# Altium project Split-Keyboard-V3-36keys.PrjPcb
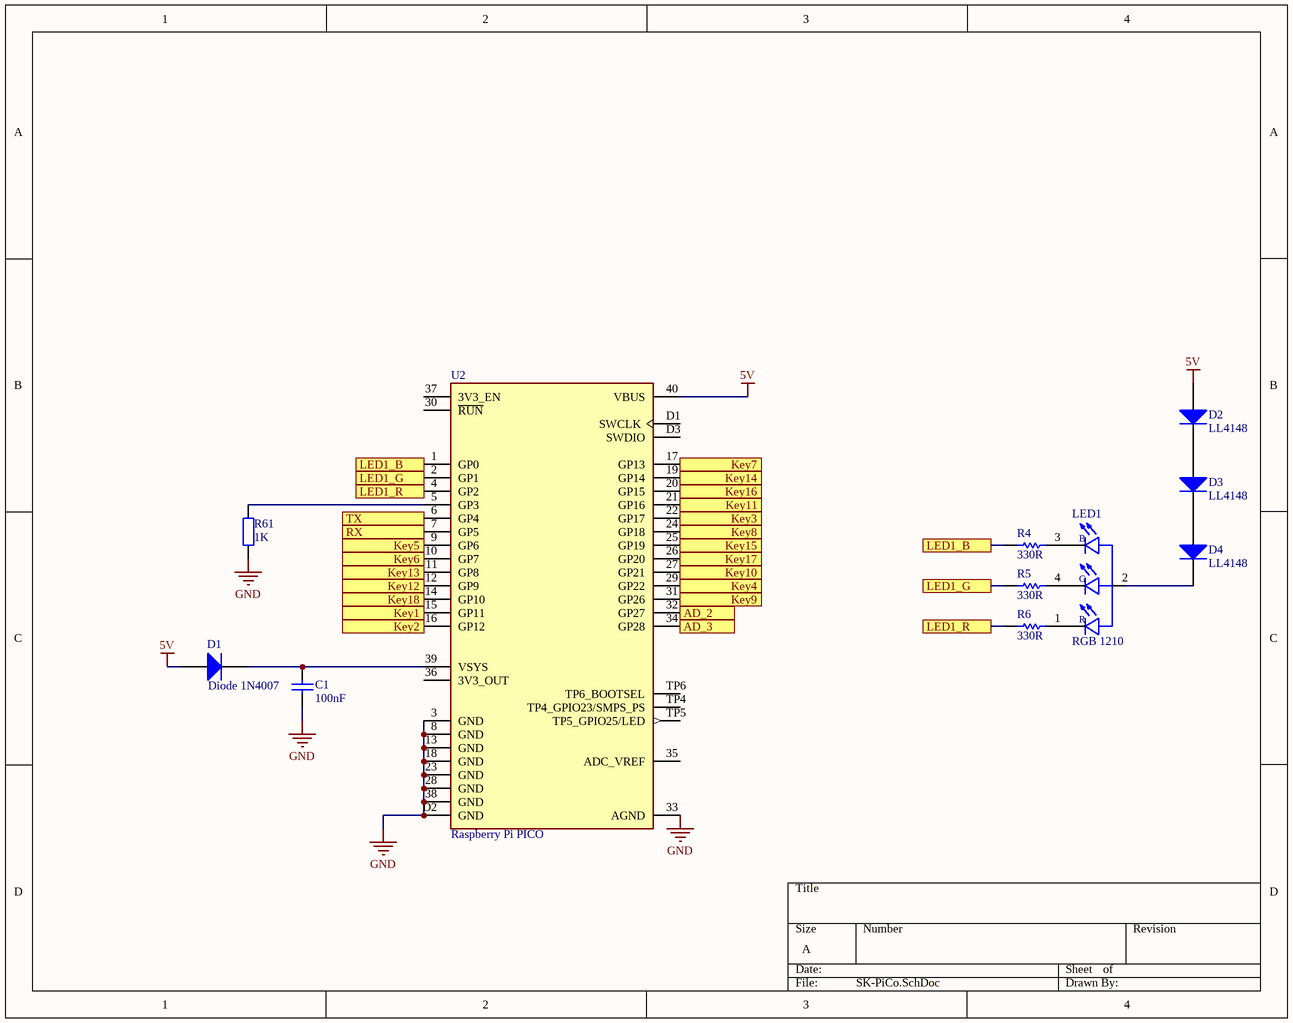
[diagram p0: SK-PiCo.SchDoc]
4 sheets, 86 parts. Net scope: flat (ports and power ports of the same name join across sheets).
Board files: SK-V101-010301.PcbDoc, SK-V101-010301-Left.PcbDoc
Sheets:
  SK-PiCo.SchDoc
  SK-Connector.SchDoc
  SK-Additional_keys.SchDoc
  SK-keys.SchDoc

## Sheet SK-PiCo.SchDoc
size A; SheetNumber: 1; SheetTotal: 4; SPICEModelCacheARYZQBPR: <root> / <DocumentId>ARYZQBPR</DocumentId> / <CacheFrame Number="0"> / <Model Name="1n4007" Kind="MDL"> / <Text>*1N4007 MCE 8-16-95 / *1000V 1A Si GenPurpose Diode pkg:DIODE0.4 1,2 / .MODEL 1N4007 D(IS=2.55E-9 RS=0.042 N=1.75 TT=5.76E-6 CJO=1.85E-11 / + VJ=0.75 M=0.333 BV=1000 IBV=9.86E-5 )</Text> / </Model> / </CacheFrame> / </root>

### Parts
C1  100nF  [SMH_RES0805-STD]
D1  Diode 1N4007  [SMH_SMA]
D2  LL4148  [SMH_MINIMELF]
D3  LL4148  [SMH_MINIMELF]
D4  LL4148  [SMH_MINIMELF]
LED1  RGB 1210  [SMH_LED_1210-RGB]
R4  330R  [SMH_1206STD]
R5  330R  [SMH_1206STD]
R6  330R  [SMH_1206STD]
R61  1K  [SMH_RES0805-STD]
U2  Raspberry Pi PICO  [SMH_PicoPi]

### Ports
AD_2, AD_3, Key1, Key2, Key3, Key4, Key5, Key6, Key7, Key8, Key9, Key10, Key11, Key12, Key13, Key14, Key15, Key16, Key17, Key18, LED1_B, LED1_G, LED1_R, RX, TX

### Nets
5V: D1.1(A) D2.1(A) U2.40(VBUS)
GND: C1.2 R61.2 U2.3(GND) U2.8(GND) U2.13(GND) U2.18(GND) U2.23(GND) U2.28(GND) U2.33(AGND) U2.38(GND) U2.D2(GND)
AD_2: U2.32(GP27) ; port AD_2
AD_3: U2.34(GP28) ; port AD_3
Key1: U2.15(GP11) ; port Key1
Key2: U2.16(GP12) ; port Key2
Key3: U2.22(GP17) ; port Key3
Key4: U2.29(GP22) ; port Key4
Key5: U2.9(GP6) ; port Key5
Key6: U2.10(GP7) ; port Key6
Key7: U2.17(GP13) ; port Key7
Key8: U2.24(GP18) ; port Key8
Key9: U2.31(GP26) ; port Key9
Key10: U2.27(GP21) ; port Key10
Key11: U2.21(GP16) ; port Key11
Key12: U2.12(GP9) ; port Key12
Key13: U2.11(GP8) ; port Key13
Key14: U2.19(GP14) ; port Key14
Key15: U2.25(GP19) ; port Key15
Key16: U2.20(GP15) ; port Key16
Key17: U2.26(GP20) ; port Key17
Key18: U2.14(GP10) ; port Key18
LED1_B: R4.2 U2.1(GP0) ; port LED1_B
LED1_G: R5.2 U2.2(GP1) ; port LED1_G
LED1_R: R6.2 U2.4(GP2) ; port LED1_R
RX: U2.7(GP5) ; port RX
TX: U2.6(GP4) ; port TX
NetC1_1: C1.1 D1.2(K) U2.39(VSYS)
NetD2_2: D2.2(K) D3.1(A)
NetD3_2: D3.2(K) D4.1(A)
NetD4_2: D4.2(K) LED1.2(Anode)
NetLED1_1: LED1.1(R) R6.1
NetLED1_3: LED1.3(B) R4.1
NetLED1_4: LED1.4(G) R5.1
NetR61_1: R61.1 U2.5(GP3)

Not connected (* = marked no-connect by the designer): U2 30(~{RUN}) 35(ADC_VREF) 36(3V3_OUT) 37(3V3_EN) D1(SWCLK) D3(SWDIO) TP4(TP4_GPIO23/SMPS_PS) TP5(TP5_GPIO25/LED) TP6(TP6_BOOTSEL)

### Library data of the parts
C1 = Cap: Capacitor; Published: 8-Jun-2000; LatestRevisionDate: 17-Jul-2002; LatestRevisionNote: Re-released for DXP Platform.; PackageReference: RAD-0.3; Publisher: Altium Limited; Value: 100nF
D1 = Diode 1N4007: 1 Amp General Purpose Rectifier; Published: 8-Jun-2000; LatestRevisionDate: 17-Jul-2002; LatestRevisionNote: Re-released for DXP Platform.; DatasheetVersion: 1998; PackageVersion: Aug-1999; PackageReference: DO-41; Publisher: Altium Limited; PackageDescription: Diode, Axial; Body 5.2 x 2.7 mm (LxDia. max), Lead Dia. 0.86 mm (max); Code_JEDEC: DO-204-AL; ComponentLink1Description: Manufacturer Link; ComponentLink1URL: http://www.fairchildsemi.com/; ComponentLink2Description: Datasheet; ComponentLink2URL: http://www.fairchildsemi.com/ds/1N%2F1N4001.pdf
D2-D4 = Diode 1N4004: 1 Amp General Purpose Rectifier; Published: 8-Jun-2000; LatestRevisionDate: 17-Jul-2002; LatestRevisionNote: Re-released for DXP Platform.; DatasheetVersion: 1998; PackageVersion: Aug-1999; PackageReference: DO-41; Publisher: Altium Limited; PackageDescription: Diode, Axial; Body 5.2 x 2.7 mm (LxDia. max), Lead Dia. 0.86 mm (max); Code_JEDEC: DO-204-AL; ComponentLink1Description: Manufacturer Link; ComponentLink1URL: http://www.fairchildsemi.com/; ComponentLink2Description: Datasheet; ComponentLink2URL: http://www.fairchildsemi.com/ds/1N%2F1N4001.pdf
LED1 = LED RGB: Value: RGB 1210
R4-R6 = Res1: Resistor; Published: 8-Jun-2000; LatestRevisionDate: 17-Jul-2002; LatestRevisionNote: Re-released for DXP Platform.; PackageReference: AXIAL-0.3; Publisher: Altium Limited; PackageDescription: Axial Device, Thru-Hole; 2 Leads; 0.3 in Pin Spacing; Value: 330R
R61 = Res2: Resistor; Published: 8-Jun-2000; LatestRevisionDate: 17-Jul-2002; LatestRevisionNote: Re-released for DXP Platform.; PackageReference: AXIAL-0.4; Publisher: Altium Limited; PackageDescription: Axial Device, Thru-Hole; 2 Leads; 0.4 in Pin Spacing; Value: 1K
U2 = PICO Pi: Value: Raspberry Pi PICO

## Sheet SK-Connector.SchDoc
size A3; SheetNumber: 2; SheetTotal: 4
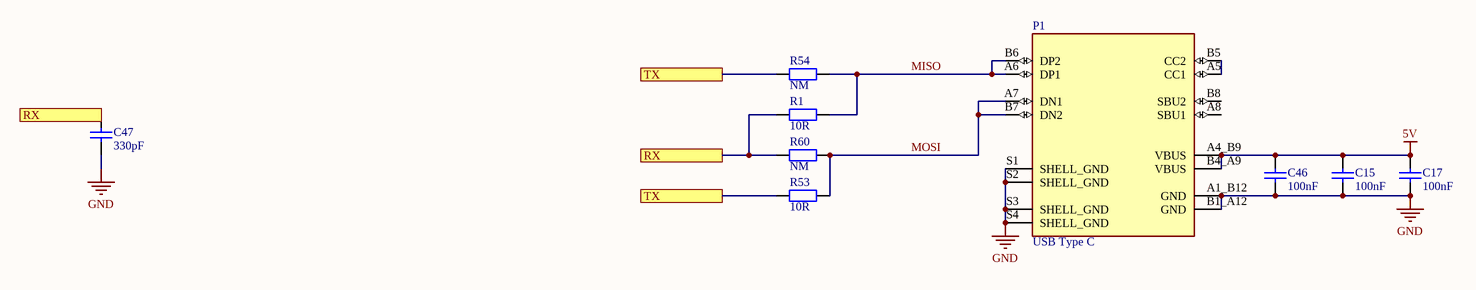
[diagram p1: SK-Connector.SchDoc]

### Parts
C15  100nF  [SMH_RES0805-STD]
C17  100nF  [SMH_RES0805-STD]
C46  100nF  [SMH_RES0805-STD]
C47  330pF  [SMH_RES0805-STD]
P1  USB Type C  [SMH_USB_C]
R1  10R  [SMH_RES0805-STD]
R53  10R  [SMH_RES0805-STD]
R54  NM  [SMH_RES0805-STD]
R60  NM  [SMH_RES0805-STD]

### Ports
RX, TX

### Nets
5V: C15.1 C17.1 C46.1 P1.A4_B9(VBUS) P1.B4_A9(VBUS)
GND: C15.2 C17.2 C46.2 C47.2 P1.A1_B12(GND) P1.B1_A12(GND) P1.S1(SHELL_GND) P1.S2(SHELL_GND) P1.S3(SHELL_GND) P1.S4(SHELL_GND)
MISO: P1.A6(DP1) P1.B6(DP2) R1.1 R54.2
MOSI: P1.A7(DN1) P1.B7(DN2) R53.2 R60.1
RX: C47.1 R1.2 R60.2 ; port RX
TX: R53.1 R54.1 ; port TX
NetP1_A5: P1.A5(CC1) P1.B5(CC2)

Not connected (* = marked no-connect by the designer): P1 A8(SBU1) B8(SBU2)

### Library data of the parts
C15 C17 C46 C47 = Cap: Capacitor; Published: 8-Jun-2000; LatestRevisionDate: 17-Jul-2002; LatestRevisionNote: Re-released for DXP Platform.; PackageReference: RAD-0.3; Publisher: Altium Limited
  C15 C17 C46: Value: 100nF
  C47: Value: 330pF
R1 R53 R54 R60 = Res2: Resistor; Published: 8-Jun-2000; LatestRevisionDate: 17-Jul-2002; LatestRevisionNote: Re-released for DXP Platform.; PackageReference: AXIAL-0.4; Publisher: Altium Limited; PackageDescription: Axial Device, Thru-Hole; 2 Leads; 0.4 in Pin Spacing
  R1 R53: Value: 10R
  R54 R60: Value: NM
P1 = USB Type C: Value: USB Type C

## Sheet SK-Additional_keys.SchDoc
size A; SheetNumber: 3; SheetTotal: 4
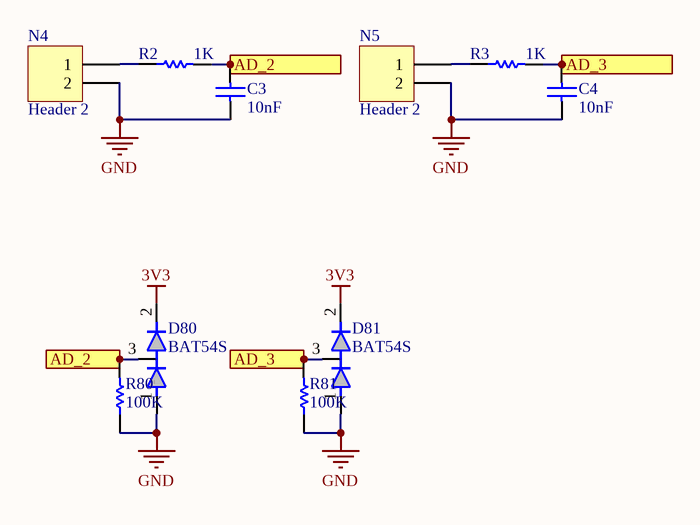
[diagram p2: SK-Additional_keys.SchDoc]

### Parts
C3  10nF  [SMH_RES0805-STD]
C4  10nF  [SMH_RES0805-STD]
D80  BAT54S  [SMH_SOT-23]
D81  BAT54S  [SMH_SOT-23]
N4  Header 2  [SMH_HDR1X2]
N5  Header 2  [SMH_HDR1X2]
R2  1K  [SMH_RES0805-STD]
R3  1K  [SMH_RES0805-STD]
R80  100K  [SMH_RES0805-STD]
R81  100K  [SMH_RES0805-STD]

### Ports
AD_2, AD_3

### Nets
3V3: D80.2 D81.2
GND: C3.2 C4.2 D80.1 D81.1 N4.2 N5.2 R80.1 R81.1
AD_2: C3.1 D80.3 R2.2 R80.2 ; port AD_2
AD_3: C4.1 D81.3 R3.2 R81.2 ; port AD_3
NetN4_1: N4.1 R2.1
NetN5_1: N5.1 R3.1

### Library data of the parts
C3 C4 = Cap: Capacitor; Published: 8-Jun-2000; LatestRevisionDate: 17-Jul-2002; LatestRevisionNote: Re-released for DXP Platform.; PackageReference: RAD-0.3; Publisher: Altium Limited; Value: 10nF
N4 N5 = Header 2: Header, 2-Pin; LatestRevisionDate: 17-Jul-2002; LatestRevisionNote: Re-released for DXP Platform.; Publisher: Altium Limited
R2 R3 R80 R81 = Res1: Resistor; Published: 8-Jun-2000; LatestRevisionDate: 17-Jul-2002; LatestRevisionNote: Re-released for DXP Platform.; PackageReference: AXIAL-0.3; Publisher: Altium Limited; PackageDescription: Axial Device, Thru-Hole; 2 Leads; 0.3 in Pin Spacing
  R2 R3: Value: 1K
  R80 R81: Value: 100K
D80 D81 = BAT54S: value: BAT54S

## Sheet SK-keys.SchDoc
size A; SheetNumber: 4; SheetTotal: 4
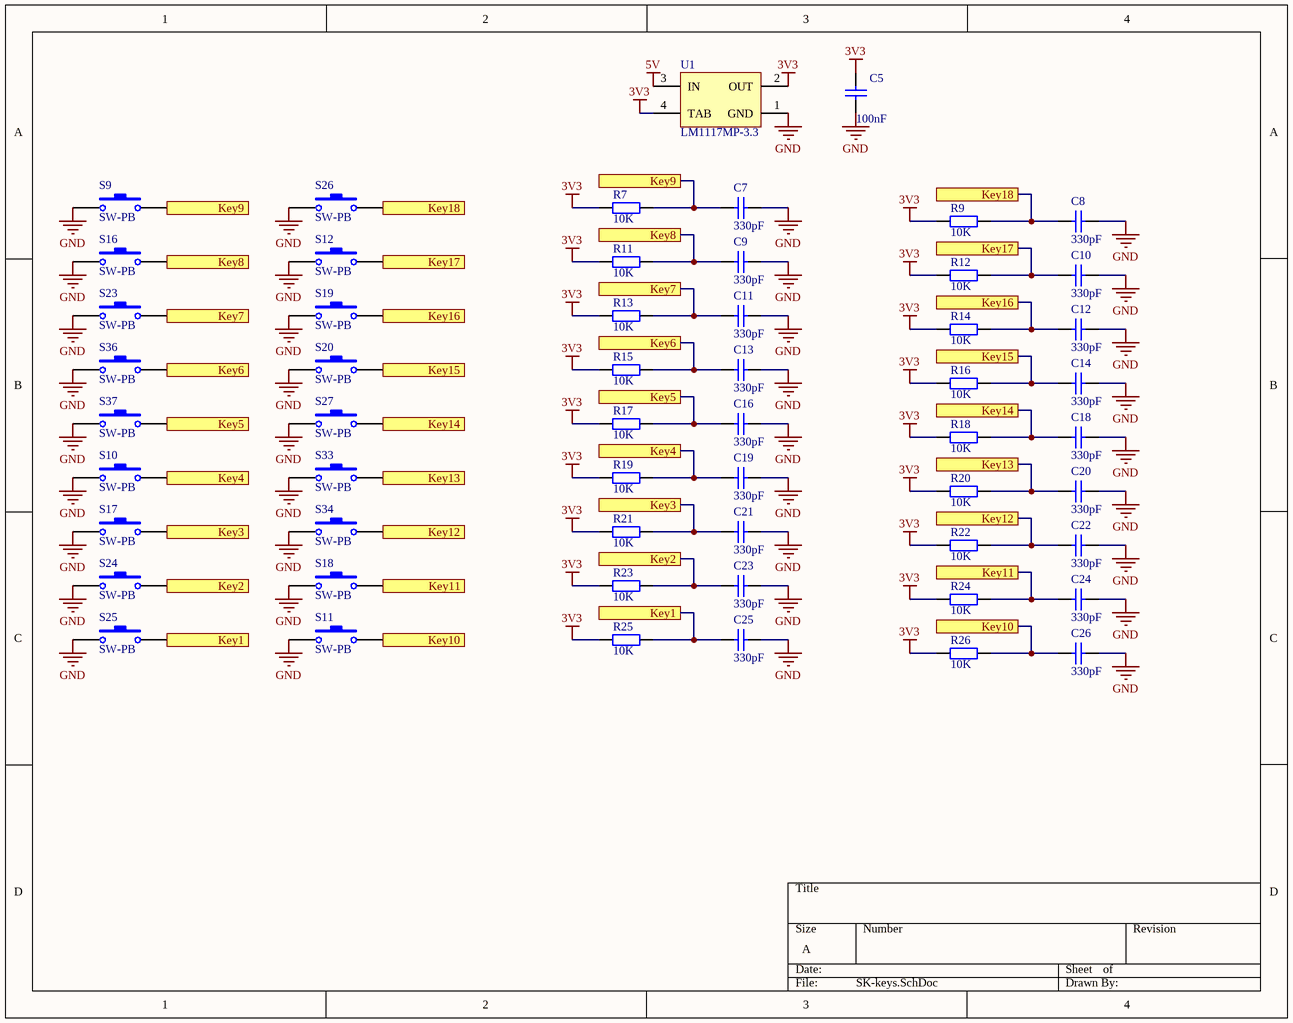
[diagram p3: SK-keys.SchDoc]

### Parts
C5  100nF  [SMH_1608[0603]_STD]
C7  330pF  [SMH_RES0805-STD]
C8  330pF  [SMH_RES0805-STD]
C9  330pF  [SMH_RES0805-STD]
C10  330pF  [SMH_RES0805-STD]
C11  330pF  [SMH_RES0805-STD]
C12  330pF  [SMH_RES0805-STD]
C13  330pF  [SMH_RES0805-STD]
C14  330pF  [SMH_RES0805-STD]
C16  330pF  [SMH_RES0805-STD]
C18  330pF  [SMH_RES0805-STD]
C19  330pF  [SMH_RES0805-STD]
C20  330pF  [SMH_RES0805-STD]
C21  330pF  [SMH_RES0805-STD]
C22  330pF  [SMH_RES0805-STD]
C23  330pF  [SMH_RES0805-STD]
C24  330pF  [SMH_RES0805-STD]
C25  330pF  [SMH_RES0805-STD]
C26  330pF  [SMH_RES0805-STD]
R7  10K  [SMH_RES0805-STD]
R9  10K  [SMH_RES0805-STD]
R11  10K  [SMH_RES0805-STD]
R12  10K  [SMH_RES0805-STD]
R13  10K  [SMH_RES0805-STD]
R14  10K  [SMH_RES0805-STD]
R15  10K  [SMH_RES0805-STD]
R16  10K  [SMH_RES0805-STD]
R17  10K  [SMH_RES0805-STD]
R18  10K  [SMH_RES0805-STD]
R19  10K  [SMH_RES0805-STD]
R20  10K  [SMH_RES0805-STD]
R21  10K  [SMH_RES0805-STD]
R22  10K  [SMH_RES0805-STD]
R23  10K  [SMH_RES0805-STD]
R24  10K  [SMH_RES0805-STD]
R25  10K  [SMH_RES0805-STD]
R26  10K  [SMH_RES0805-STD]
S9  SW-PB  [SMH_MX_Series_18mm]
S10  SW-PB  [SMH_MX_Series_18mm]
S11  SW-PB  [SMH_MX_Series_18mm]
S12  SW-PB  [SMH_MX_Series_18mm]
S16  SW-PB  [SMH_MX_Series_18mm]
S17  SW-PB  [SMH_MX_Series_18mm]
S18  SW-PB  [SMH_MX_Series_18mm]
S19  SW-PB  [SMH_MX_Series_18mm]
S20  SW-PB  [SMH_MX_Series_18mm]
S23  SW-PB  [SMH_MX_Series_18mm]
S24  SW-PB  [SMH_MX_Series_18mm]
S25  SW-PB  [SMH_MX_Series_18mm]
S26  SW-PB  [SMH_MX_Series_18mm]
S27  SW-PB  [SMH_MX_Series_18mm]
S33  SW-PB  [SMH_MX_SERIES-37MM]
S34  SW-PB  [SMH_MX_Series_18mm]
S36  SW-PB  [SMH_MX_Series-37mm]
S37  SW-PB  [SMH_MX_Series-42mm]
U1  LM1117MP-3.3  [SMH_SOT223]

### Ports
Key1, Key2, Key3, Key4, Key5, Key6, Key7, Key8, Key9, Key10, Key11, Key12, Key13, Key14, Key15, Key16, Key17, Key18

### Nets
3V3: C5.2 R7.1 R9.1 R11.1 R12.1 R13.1 R14.1 R15.1 R16.1 R17.1 R18.1 R19.1 R20.1 R21.1 R22.1 R23.1 R24.1 R25.1 R26.1 U1.2(OUT) U1.4(TAB)
5V: U1.3(IN)
GND: C5.1 C7.2 C8.2 C9.2 C10.2 C11.2 C12.2 C13.2 C14.2 C16.2 C18.2 C19.2 C20.2 C21.2 C22.2 C23.2 C24.2 C25.2 C26.2 S9.1 S10.1 S11.1 S12.1 S16.1 S17.1 S18.1 S19.1 S20.1 S23.1 S24.1 S25.1 S26.1 S27.1 S33.1 S34.1 S36.2 S37.2 U1.1(GND)
Key1: C25.1 R25.2 S25.2 ; port Key1
Key2: C23.1 R23.2 S24.2 ; port Key2
Key3: C21.1 R21.2 S17.2 ; port Key3
Key4: C19.1 R19.2 S10.2 ; port Key4
Key5: C16.1 R17.2 S37.1 ; port Key5
Key6: C13.1 R15.2 S36.1 ; port Key6
Key7: C11.1 R13.2 S23.2 ; port Key7
Key8: C9.1 R11.2 S16.2 ; port Key8
Key9: C7.1 R7.2 S9.2 ; port Key9
Key10: C26.1 R26.2 S11.2 ; port Key10
Key11: C24.1 R24.2 S18.2 ; port Key11
Key12: C22.1 R22.2 S34.2 ; port Key12
Key13: C20.1 R20.2 S33.2 ; port Key13
Key14: C18.1 R18.2 S27.2 ; port Key14
Key15: C14.1 R16.2 S20.2 ; port Key15
Key16: C12.1 R14.2 S19.2 ; port Key16
Key17: C10.1 R12.2 S12.2 ; port Key17
Key18: C8.1 R9.2 S26.2 ; port Key18

### Library data of the parts
C5 = Cap Semi: Capacitor (Semiconductor SIM Model); Published: 8-Jun-2000; LatestRevisionDate: 29-May-2009; LatestRevisionNote: IPC-7351 Footprint Added.; PackageReference: C1206; Publisher: Altium Limited; PackageDescription: Chip Capacitor; Value: 100nF
C7-C14 C16 C18-C26 = Cap: Capacitor; Published: 8-Jun-2000; LatestRevisionDate: 17-Jul-2002; LatestRevisionNote: Re-released for DXP Platform.; PackageReference: RAD-0.3; Publisher: Altium Limited; Value: 330pF
R7 R9 R11-R26 = Res2: Resistor; Published: 8-Jun-2000; LatestRevisionDate: 17-Jul-2002; LatestRevisionNote: Re-released for DXP Platform.; PackageReference: AXIAL-0.4; Publisher: Altium Limited; PackageDescription: Axial Device, Thru-Hole; 2 Leads; 0.4 in Pin Spacing; Value: 10K
S9-S12 S16-S20 S23-S27 S33 S34 S36 S37 = SW-PB: Switch; Published: 24-Mar-1999; LatestRevisionDate: 17-Jul-2002; LatestRevisionNote: Re-released for DXP Platform.; PackageReference: SPST-2; Publisher: Altium Limited; PackageDescription: Switch; 2 Leads
U1 = LM1117MP-3.3: 800mA Low-Dropout Linear Regulator, 4-pin SOT-223; Manufacturer: National Semiconductor; PackageTopMarking: XYTT*N05A; PowerWise: N; CompType: LDO IC; Published: 4-Dec-2008; DatasheetVersion: Apr-2006; PackageVersion: revB, Apr-2003; PackageReference: MP04A; Publisher: Altium Limited; PackageDescription: Molded SOT-223, 6.50 x 3.56 x 1.6mm Body, 4 Lead, 2.3mm Pitch; Supplier 1: Farnell; Supplier Part Number 1: 9778195; Supplier 2: Farnell; Supplier Part Number 2: 9778195RL; PartNumber: LM1117MP-3.3; RoHS: N; PinCount: 4; Code_JEDEC: TO-261-AA; Code_IPC: SOT223-4; ComponentLink1Description: LM1117 Datasheet; ComponentLink1URL: http://www.national.com/ds/LM/LM1117.pdf; ComponentLink2Description: LM1117 Web Page; ComponentLink2URL: http://www.national.com/pf/LM/LM1117.html; ComponentLink3Description: MP04A Package Page; ComponentLink3URL: http://www.national.com/packaging/folders/mp04a.html

## Nets that join several sheets
3V3: SK-Additional_keys (D80.2 D81.2), SK-keys (21 pins)
5V: SK-PiCo (D1.1 D2.1 U2.40), SK-Connector (5 pins), SK-keys (U1.3)
GND: SK-PiCo (11 pins), SK-Connector (10 pins), SK-Additional_keys (8 pins), SK-keys (38 pins)
AD_2: SK-PiCo (U2.32), SK-Additional_keys (C3.1 D80.3 R2.2 R80.2)
AD_3: SK-PiCo (U2.34), SK-Additional_keys (C4.1 D81.3 R3.2 R81.2)
Key1: SK-PiCo (U2.15), SK-keys (C25.1 R25.2 S25.2)
Key2: SK-PiCo (U2.16), SK-keys (C23.1 R23.2 S24.2)
Key3: SK-PiCo (U2.22), SK-keys (C21.1 R21.2 S17.2)
Key4: SK-PiCo (U2.29), SK-keys (C19.1 R19.2 S10.2)
Key5: SK-PiCo (U2.9), SK-keys (C16.1 R17.2 S37.1)
Key6: SK-PiCo (U2.10), SK-keys (C13.1 R15.2 S36.1)
Key7: SK-PiCo (U2.17), SK-keys (C11.1 R13.2 S23.2)
Key8: SK-PiCo (U2.24), SK-keys (C9.1 R11.2 S16.2)
Key9: SK-PiCo (U2.31), SK-keys (C7.1 R7.2 S9.2)
Key10: SK-PiCo (U2.27), SK-keys (C26.1 R26.2 S11.2)
Key11: SK-PiCo (U2.21), SK-keys (C24.1 R24.2 S18.2)
Key12: SK-PiCo (U2.12), SK-keys (C22.1 R22.2 S34.2)
Key13: SK-PiCo (U2.11), SK-keys (C20.1 R20.2 S33.2)
Key14: SK-PiCo (U2.19), SK-keys (C18.1 R18.2 S27.2)
Key15: SK-PiCo (U2.25), SK-keys (C14.1 R16.2 S20.2)
Key16: SK-PiCo (U2.20), SK-keys (C12.1 R14.2 S19.2)
Key17: SK-PiCo (U2.26), SK-keys (C10.1 R12.2 S12.2)
Key18: SK-PiCo (U2.14), SK-keys (C8.1 R9.2 S26.2)
RX: SK-PiCo (U2.7), SK-Connector (C47.1 R1.2 R60.2)
TX: SK-PiCo (U2.6), SK-Connector (R53.1 R54.1)